# Altium schematic sheet McuMemory.SchDoc
size A4; DocumentNumber: 2; SheetNumber: 2; SheetTotal: 2; Address1: L3, 12a Rodborough Rd; Address2: Frenchs Forest; Address3: NSW; Address4: Australia 2086; Organization: Altium Limited
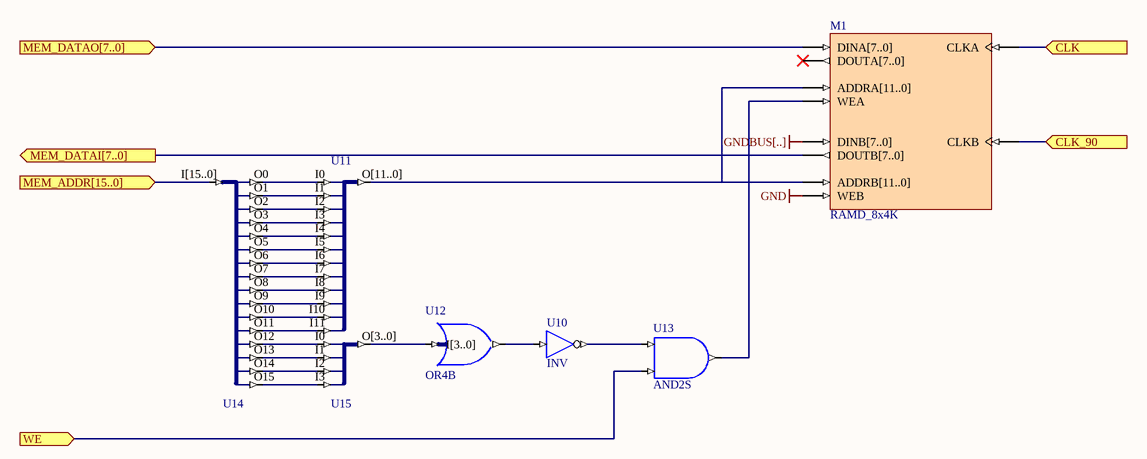
[diagram p0: McuMemory.SchDoc]

## Parts
M1  RAMD_8x4K
U10  INV
U11  J12S_12B  (value not drawn)
U12  OR4B
U13  AND2S
U14  J16B_16S  (value not drawn)
U15  J4S_4B  (value not drawn)

## Ports
CLK (in), CLK_90 (in), MEM_ADDR[15..0] (in), MEM_DATAI[7..0] (out), MEM_DATAO[7..0] (in), WE (in)

## Nets
GND: M1.WEB
GNDBUS[..]: M1.DINB[7..0]
CLK: M1.CLKA ; port CLK
CLK_90: M1.CLKB ; port CLK_90
MEM_ADDR[15..0]: U14.I[15..0] ; port MEM_ADDR[15..0]
MEM_DATAI[7..0]: M1.DOUTB[7..0] ; port MEM_DATAI[7..0]
MEM_DATAO[7..0]: M1.DINA[7..0] ; port MEM_DATAO[7..0]
WE: U13.I1 ; port WE
NetM1_ADDRA[11..0]: M1.ADDRA[11..0] M1.ADDRB[11..0] U11.O[11..0]
NetM1_WEA: M1.WEA U13.O
NetU10_I: U10.I U12.O
NetU10_O: U10.O U13.I0
NetU11_I0: U11.I0 U14.O0
NetU11_I1: U11.I1 U14.O1
NetU11_I2: U11.I2 U14.O2
NetU11_I3: U11.I3 U14.O3
NetU11_I4: U11.I4 U14.O4
NetU11_I5: U11.I5 U14.O5
NetU11_I6: U11.I6 U14.O6
NetU11_I7: U11.I7 U14.O7
NetU11_I8: U11.I8 U14.O8
NetU11_I9: U11.I9 U14.O9
NetU11_I10: U11.I10 U14.O10
NetU11_I11: U11.I11 U14.O11
NetU12_I[3..0]: U12.I[3..0] U15.O[3..0]
NetU14_O12: U14.O12 U15.I0
NetU14_O13: U14.O13 U15.I1
NetU14_O14: U14.O14 U15.I2
NetU14_O15: U14.O15 U15.I3

Not connected (* = marked no-connect by the designer): M1 DOUTA[7..0]*

## Notes on the sheet
- Title
- Size:
- Date:
- A4
- Number:
- Time:
- Revision:
- Sheet
- of
- File:

## Library data of the parts
M1 = RAMD_8x4K: Dual Port Random Access Memory; Memory_DepthA: 4096; Memory_Type: RAM_DualPortBlock; Memory_WidthA: 8; Memory_ClockEdge: Rising; Nexus_Core: Memory_Program; Published: 13/01/2004; Publisher: Altium Hobart Technology Center; Memory_DepthB: 4096; Memory_WidthB: 8
U10 = INV: Inverter; ArchiveName: GENERIC; VHDLIB_SIM: GENERIC_LIB; Published: 29-Jan-2004; Publisher: Altium Limited; Xilinx Equivalent: INV; Core Revision: 1.00.00
U11 = J12S_12B: 12 Single pin inputs to single 12-Bit output bus; Functional Class: Bus Joiner; Port Size: 12; ArchiveName: GENERIC; VHDLIB_SIM: GENERIC_LIB; Published: 29-Jan-2004; Publisher: Altium Limited; Core Revision: 1.00.00; HelpURL: CR0118 FPGA Generic Library Guide.pdf#page=305
U12 = OR4B: 4-Input OR Gate, Bus Version; ArchiveName: GENERIC; VHDLIB_SIM: GENERIC_LIB; Published: 29-Jan-2004; Publisher: Altium Limited; Core Revision: 1.00.00
U13 = AND2S: 2-Input AND Gate, Single Pin Version; Xilinx Equivalent: AND2; ArchiveName: GENERIC; VHDLIB_SIM: GENERIC_LIB; Published: 29-Jan-2004; Publisher: Altium Limited; Core Revision: 1.00.00
U14 = J16B_16S: Single 16-Bit input bus to 16 single pin outputs; Functional Class: Bus Joiner; Port Size: 16; ArchiveName: GENERIC; VHDLIB_SIM: GENERIC_LIB; Published: 29-Jan-2004; Publisher: Altium Limited; Core Revision: 1.00.00; HelpURL: CR0118 FPGA Generic Library Guide.pdf#page=303
U15 = J4S_4B: 4 Single pin inputs to single 4-Bit output bus; Functional Class: Bus Joiner; Port Size: 4; ArchiveName: GENERIC; VHDLIB_SIM: GENERIC_LIB; Published: 29-Jan-2004; Publisher: Altium Limited; Core Revision: 1.00.00; HelpURL: CR0118 FPGA Generic Library Guide.pdf#page=305